# EAGLE design Netzteil_CA1_Frontpanel (EAGLE 8.6.3)
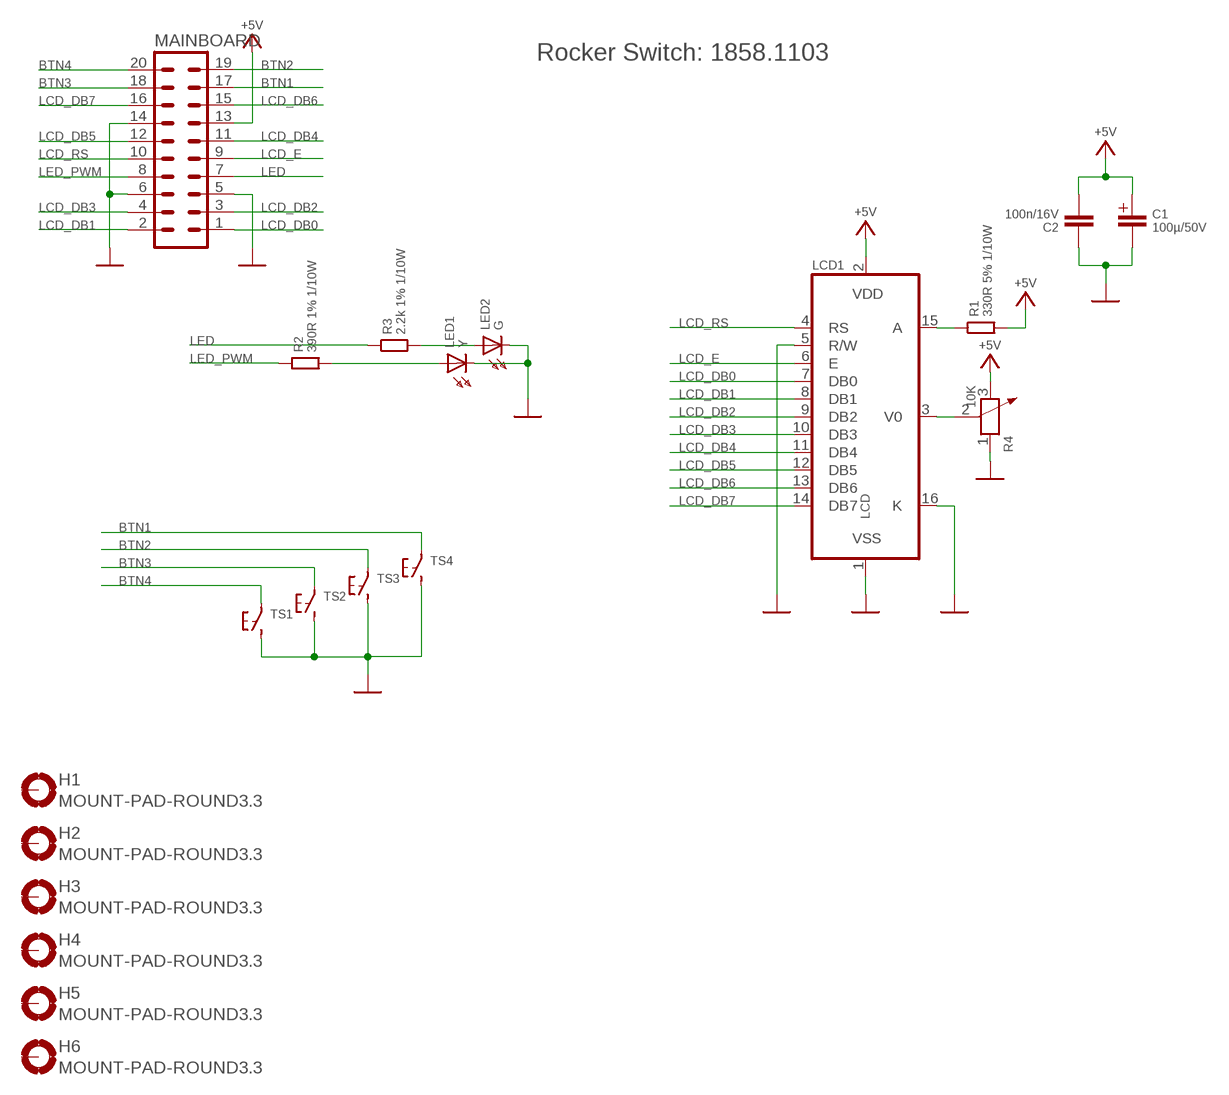
[diagram p0: schematic, sheet 1]

## Parts
C1  100µ/50V  C+3.5/8  [C+/3.5/8]
C2  100n/16V  CC/0805  [0805]
H1  MOUNT-PAD-ROUND3.3  [3,3-PAD]
H2  MOUNT-PAD-ROUND3.3  [3,3-PAD]
H3  MOUNT-PAD-ROUND3.3  [3,3-PAD]
H4  MOUNT-PAD-ROUND3.3  [3,3-PAD]
H5  MOUNT-PAD-ROUND3.3  [3,3-PAD]
H6  MOUNT-PAD-ROUND3.3  [3,3-PAD]
LCD1  LCD  [DISPLAYTECH-204C]
LED1  Y  LED0805  [LED0805]
LED2  G  LED0805  [LED0805]
MAINBOARD  MA10-2  [MA10-2]
R1  330R 5% 1/10W  R-SMD0805  [C0805K]
R2  390R 1% 1/10W  R-SMD0805  [C0805K]
R3  2.2k 1% 1/10W  R-SMD0805  [C0805K]
R4  10K  TRIMPOT  [ADJR3-7.0X7.0X5.0MM]
TS1  TS1B3F-10XX  [B3F-10XX]
TS2  TS1B3F-10XX  [B3F-10XX]
TS3  TS1B3F-10XX  [B3F-10XX]
TS4  TS1B3F-10XX  [B3F-10XX]

## Nets
+5V: C1.+ C2.2 LCD1.2(VDD) MAINBOARD.13 R1.2 R4.3
BTN1: MAINBOARD.17 TS4.1
BTN2: MAINBOARD.19 TS3.1
BTN3: MAINBOARD.18 TS2.1
BTN4: MAINBOARD.20 TS1.1
LCD_DB0: LCD1.7(DB0) MAINBOARD.1
LCD_DB1: LCD1.8(DB1) MAINBOARD.2
LCD_DB2: LCD1.9(DB2) MAINBOARD.3
LCD_DB3: LCD1.10(DB3) MAINBOARD.4
LCD_DB4: LCD1.11(DB4) MAINBOARD.11
LCD_DB5: LCD1.12(DB5) MAINBOARD.12
LCD_DB6: LCD1.13(DB6) MAINBOARD.15
LCD_DB7: LCD1.14(DB7) MAINBOARD.16
LCD_E: LCD1.6(E) MAINBOARD.9
LCD_RS: LCD1.4(RS) MAINBOARD.10
LED: MAINBOARD.7 R3.1
LED_PWM: MAINBOARD.8 R2.1
N$4: LCD1.3(V0) R4.2
N$7: LCD1.15(A) R1.1
N$8: LED2.A R3.2
N$9: LED1.A R2.2
VSS: C1.- C2.1 LCD1.1(VSS) LCD1.5(R/W) LCD1.16(K) LED1.C LED2.C MAINBOARD.5 MAINBOARD.6 MAINBOARD.14 R4.1 TS1.3 TS2.3 TS3.3 TS4.3
Unconnected: H1.B3,3(MOUNT) H2.B3,3(MOUNT) H3.B3,3(MOUNT) H4.B3,3(MOUNT) H5.B3,3(MOUNT) H6.B3,3(MOUNT)

## Notes on the sheet
- Rocker Switch: 1858.1103

## Library data of the parts
C1 = neumluc:C+; OC_MOUSER: 667-EEU-FR1H101
C2 = goujine:C: Kondensator; OC_MOUSER: 810-C2012X7R2A104K
H1-H6 = holes:MOUNT-PAD-ROUND: MOUNTING PAD, round; SCREW: M3x5
LCD1 = neumluc:LCD; OC_MOUSER: 992-LCD-20X4Y
LED1 = neumluc:LED: LED; OC_MOUSER: 710-150080YS75000; OC_MOUSER_ADD: 593-LFC025CTP
LED2 = neumluc:LED: LED; OC_MOUSER: 710-150080GS75000; OC_MOUSER_ADD: 593-LFC025CTP
MAINBOARD = con-lstb:MA10-2: PIN HEADER; OC_FARNELL: unknown; OC_MOUSER: 200-TSW10707FD; OC_NEWARK: unknown; OC_RS: 832-3516
R1 = neumluc:R-SMD: R SMD; OC_MOUSER: 652-CR0805FX-3300ELF
R2 = neumluc:R-SMD: R SMD; OC_MOUSER: 652-CR0805FX-3900ELF
R3 = neumluc:R-SMD: R SMD; OC_MOUSER: 652-CR0805FX-2201ELF
R4 = neumluc:TRIMPOT: 301040009; MPN: SX3362P; OC_MOUSER: 652-3362P-1-103LF
TS1-TS4 = neumluc:TS1; OC_MOUSER: 653-B3F-1022

## Board
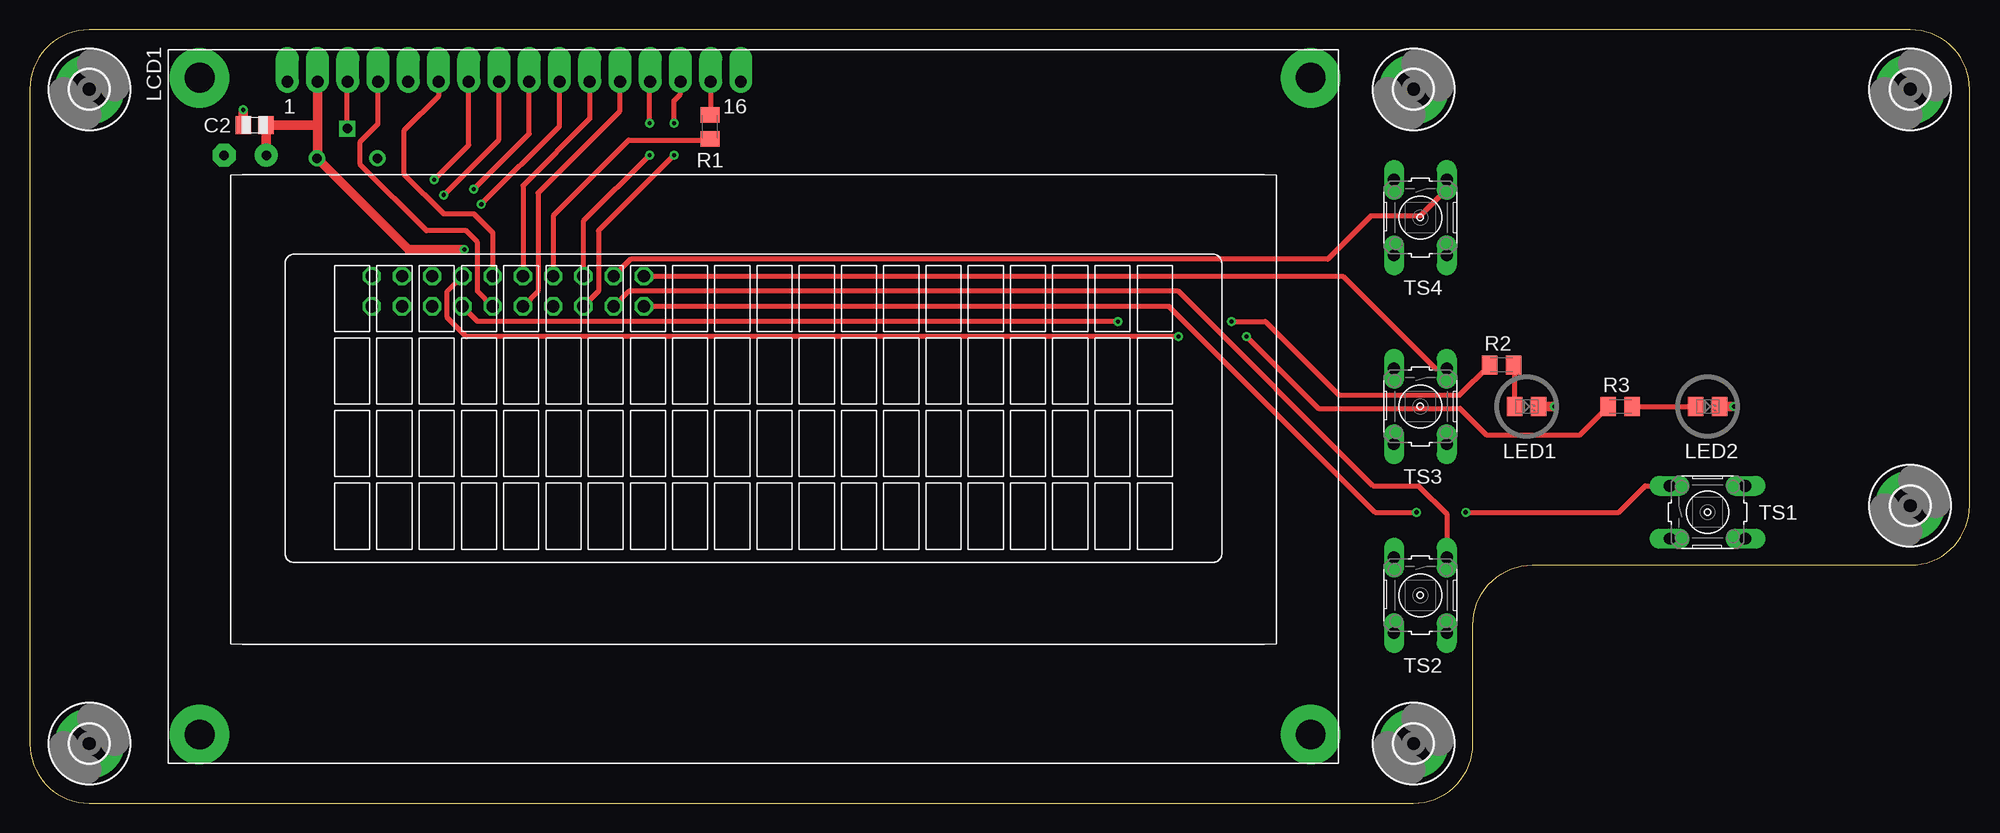
[diagram p1: board, top side]
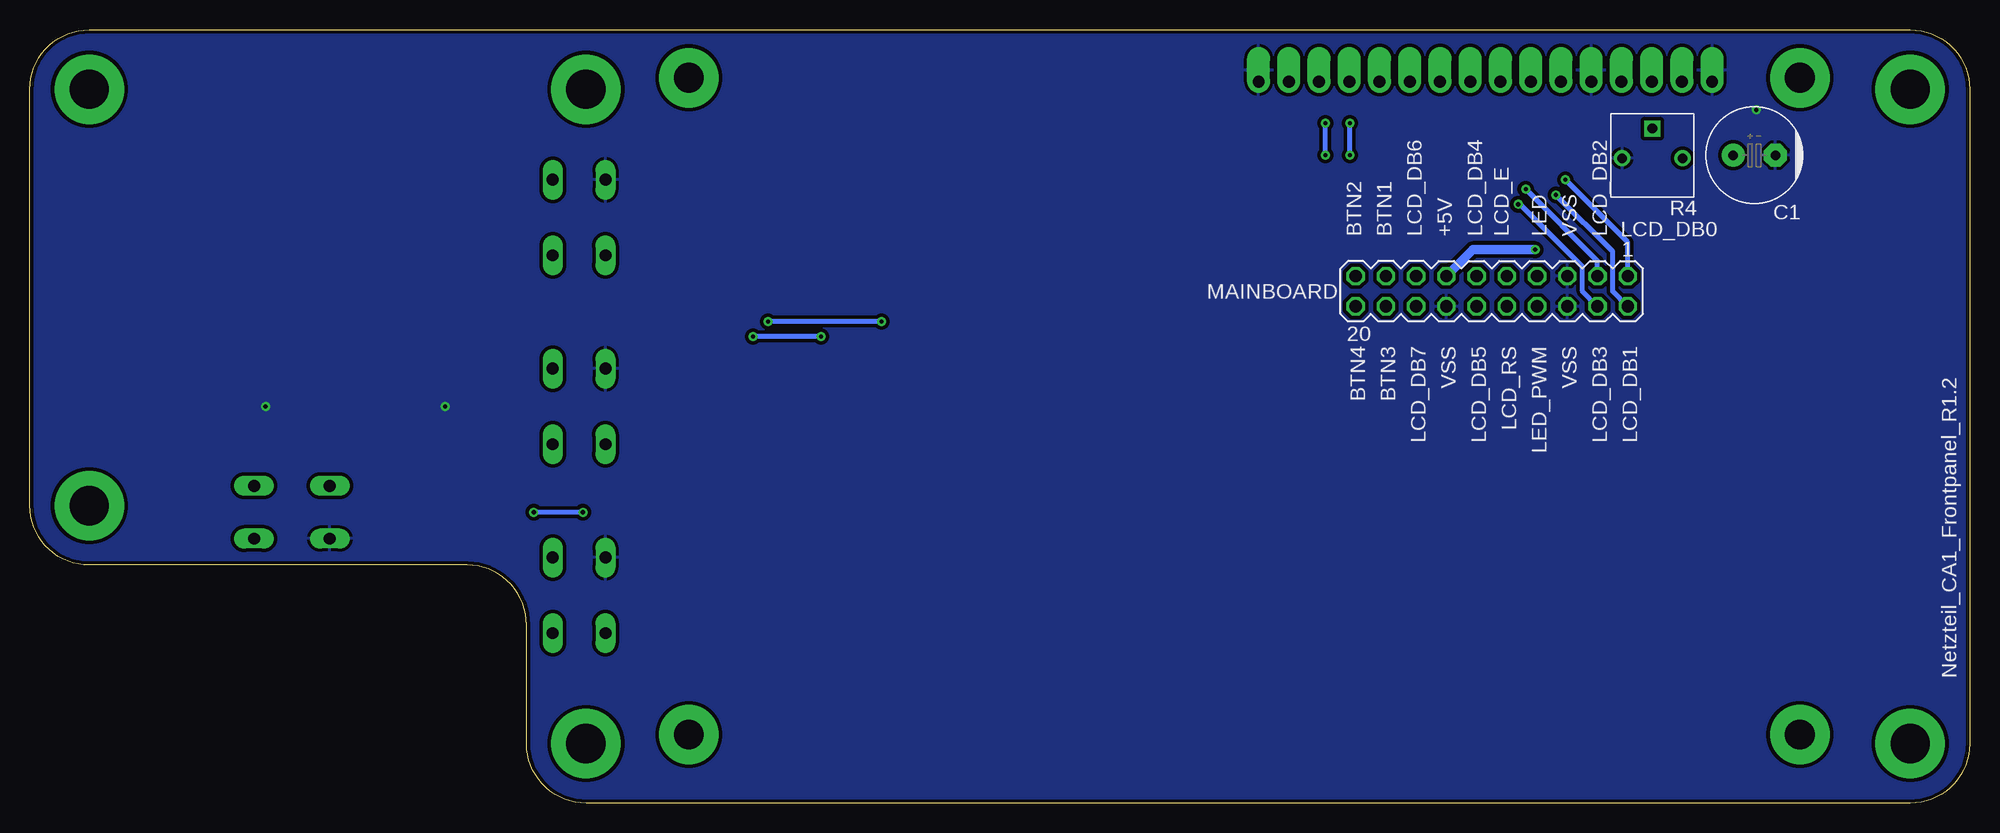
[diagram p2: board, bottom side, seen from below]

Size 163 x 65 mm. Coordinates in mm from the lower left corner, seen from the top.
Outline: 121.27,5 121.27,15 arc-90 126.27,20 158,20 arc90 163,25 163,60 arc90 158,65 5,65 arc90 0,60 0,5 arc90 5,0 116.27,0 arc90 121.27,5
Copper layers (1*16): Top 0.035mm / dielectric 1.5mm / Bottom 0.035mm
Design rules "default *": minimum track width 5mil, minimum drill 0.35mm, track to track 5mil, track to pad 5mil, pad to pad 5mil, via to via 5mil, smd to smd 5mil, copper to edge 8mil, drill to drill 6mil, minimum pad ring 10mil, minimum via ring 8mil, stop-mask expansion 4mil, vias tented up to drill 0mil, thermal gap 10mil

### Footprints (pad centres in the part's own frame; a part is rotated, then mirrored left to right if it is on the bottom)
C+/3.5/8 = drill 0.813 pad 1.93: + -1.778,0 | drill 0.813 pad 1.93 octagon: - 1.778,0
0805 = smd 1.3 x 1.5: 1 -0.953,0; 2 0.953,0
3,3-PAD = drill 3.3 pad 5.842: B3,3 0,0
DISPLAYTECH-204C = drill 1 pad 1.93 offset: 1 -39.154,27.3; 2 -36.614,27.3; 3 -34.074,27.3; 4 -31.534,27.3; 5 -28.994,27.3; 6 -26.454,27.3; 7 -23.914,27.3; 8 -21.374,27.3; 9 -18.834,27.3; 10 -16.294,27.3; 11 -13.754,27.3; 12 -11.214,27.3; 13 -8.674,27.3; 14 -6.134,27.3; 15 -3.594,27.3; 16 -1.054,27.3 | drill 2.5 pad 5: P$17 -46.525,27.625; P$18 -46.525,-27.575; P$19 46.825,27.625; P$20 46.825,-27.575
LED0805 = smd 1.3 x 1.6: A 1,0; C -1,0
MA10-2 = drill 1.016 octagon: 1 -11.43,-1.27; 2 -11.43,1.27; 3 -8.89,-1.27; 4 -8.89,1.27; 5 -6.35,-1.27; 6 -6.35,1.27; 7 -3.81,-1.27; 8 -3.81,1.27; 9 -1.27,-1.27; 10 -1.27,1.27; 11 1.27,-1.27; 12 1.27,1.27; 13 3.81,-1.27; 14 3.81,1.27; 15 6.35,-1.27; 16 6.35,1.27; 17 8.89,-1.27; 18 8.89,1.27; 19 11.43,-1.27; 20 11.43,1.27
C0805K = smd 1.3 x 1.6: 1 -1,0; 2 1,0
ADJR3-7.0X7.0X5.0MM = drill 0.8 pad 1.35: 1 -2.54,-0.25; 3 2.54,-0.25 | drill 0.8 pad 1.35 square: 2 0,2.25
B3F-10XX = drill 1 pad 1.676 long: 1 -3.175,1.905; 2 3.175,1.905; 3 -3.175,-2.54; 4 3.175,-2.54

### Placement (x,y rotation side)
C1  18.1,54.45 0 bottom
C2  18.89,56.99 0 top
H1  5,60 0 top
H2  5,5 0 top
H3  116.27,5 0 top
H4  116.27,60 0 top
H5  158,60 0 top
H6  158,25 0 top
LCD1  60.8,33.34 0 top
LED1  125.77,33.34 180 top
LED2  140.97,33.34 180 top
MAINBOARD  40.16,43.02 180 bottom
R1  57.15,56.83 270 top
R2  123.67,36.83 0 top
R3  133.62,33.34 0 top
R4  26.67,54.45 0 bottom
TS1  140.97,24.77 0 top
TS2  117.16,17.46 270 top
TS3  117.16,33.34 270 top
TS4  117.16,49.21 270 top

### Tracks (layer width: path | path; a pad name or v marks a point on that pad's centre or on a via)
+5V  (via drill 0.35)
  Top 0.406: 57.04,55.72 50.32,55.72 43.97,49.37 MAINBOARD.13
  Top 0.813: 57.04,55.72 R1.2 | v36.51,46.51 31.82,46.51 R4.3 24.19,54.26 24.19,56.99 | LCD1.2 24.19,56.99 | 24.19,56.99 C2.2 19.88,56.96 C1.+
  Bottom 0.813: v36.51,46.51 41.75,46.51 MAINBOARD.13
BTN1
  Top 0.406: TS4.1 119.06,51.59 116.84,49.37 112.71,49.37 109.06,45.72 50.48,45.72 MAINBOARD.17
BTN2
  Top 0.406: TS3.1 118.11,36.51 110.33,44.29 MAINBOARD.19
BTN3
  Top 0.406: TS2.1 119.06,24.29 116.68,26.67 112.87,26.67 96.52,43.02 50.32,43.02 MAINBOARD.18
BTN4  (via drill 0.35)
  Top 0.406: TS1.1 135.73,26.67 133.51,24.45 v120.65,24.45 | v116.52,24.45 113.03,24.45 95.73,41.75 MAINBOARD.20
  Bottom 0.406: v116.52,24.45 v120.65,24.45
LCD_DB0  (via drill 0.35)
  Top 0.406: v33.97,52.39 36.89,55.3 LCD1.7
  Bottom 0.406: MAINBOARD.1 28.73,47.15 v33.97,52.39
LCD_DB1  (via drill 0.35)
  Top 0.406: v34.77,51.12 39.43,55.78 LCD1.8
  Bottom 0.406: MAINBOARD.2 30,43.02 30,46.35 v34.77,51.12
LCD_DB2  (via drill 0.35)
  Top 0.406: v37.31,51.59 41.97,56.26 LCD1.9
  Bottom 0.406: MAINBOARD.3 31.27,45.56 v37.31,51.59
LCD_DB3  (via drill 0.35)
  Top 0.406: v37.94,50.32 44.51,56.89 LCD1.10
  Bottom 0.406: MAINBOARD.4 32.54,43.02 32.54,45.09 37.78,50.32 v37.94,50.32
LCD_DB4
  Top 0.406: LCD1.11 47.05,57.52 41.43,51.91 MAINBOARD.11
LCD_DB5
  Top 0.406: LCD1.12 49.59,58.16 42.7,51.28 42.7,43.02 MAINBOARD.12
LCD_DB6  (via drill 0.35)
  Top 0.406: v52.07,54.45 46.51,48.9 MAINBOARD.15 | v52.07,57.15 52.07,60.58 LCD1.13
  Bottom 0.406: v52.07,54.45 v52.07,57.15
LCD_DB7  (via drill 0.35)
  Top 0.406: v54.13,57.15 54.13,59.05 54.67,59.59 LCD1.14 | v54.13,54.45 47.78,48.1 47.78,43.02 MAINBOARD.16
  Bottom 0.406: v54.13,54.45 v54.13,57.15
LCD_E
  Top 0.406: LCD1.6 34.35,59.43 31.43,56.52 31.43,52.86 34.77,49.53 37.31,49.53 38.89,47.94 MAINBOARD.9
LCD_RS
  Top 0.406: LCD1.4 29.27,57.09 27.78,55.61 27.78,53.66 33.34,48.1 36.67,48.1 37.62,47.15 37.62,43.02 MAINBOARD.10
LED  (via drill 0.35)
  Top 0.406: v96.52,39.21 36.67,39.21 35.08,40.8 35.08,43.02 MAINBOARD.7 | R3.1 130.24,30.96 122.4,30.96 120.17,33.18 108.27,33.18 v102.23,39.21
  Bottom 0.406: v96.52,39.21 v102.23,39.21
LED_PWM  (via drill 0.35)
  Top 0.406: v91.44,40.48 37.62,40.48 MAINBOARD.8 | v100.97,40.48 103.82,40.48 110.01,34.29 120.13,34.29 R2.1
  Bottom 0.406: v91.44,40.48 v100.97,40.48
N$4
  Top 0.406: R4.2 26.67,60.58 LCD1.3
N$7
  Top 0.406: LCD1.15 57.21,57.89 R1.1
N$8
  Top 0.406: R3.2 LED2.A
N$9
  Top 0.406: LED1.A 124.77,36.72 R2.2
VSS  (via drill 0.35)
  Top 0.813: LED1.C v128.11,33.34 | LED2.C v143.19,33.34 | C2.1 v17.94,58.26
  pour Bottom (isolate 0.305): 0,0 126.68,0 126.68,20 163,20 163,65 0,65

### Text on the board
bNames: LCD_DB0 | LCD_DB2 | VSS | LED | LCD_E | LCD_DB4 | +5V | LCD_DB6 | BTN1 | BTN2 | LCD_DB1 | LCD_DB3 | VSS | LED_PWM | LCD_RS | LCD_DB5 | VSS | LCD_DB7 | BTN3 | BTN4 | Netzteil_CA1_Frontpanel_R1.2